# Altium schematic sheet top.SchDoc
size A
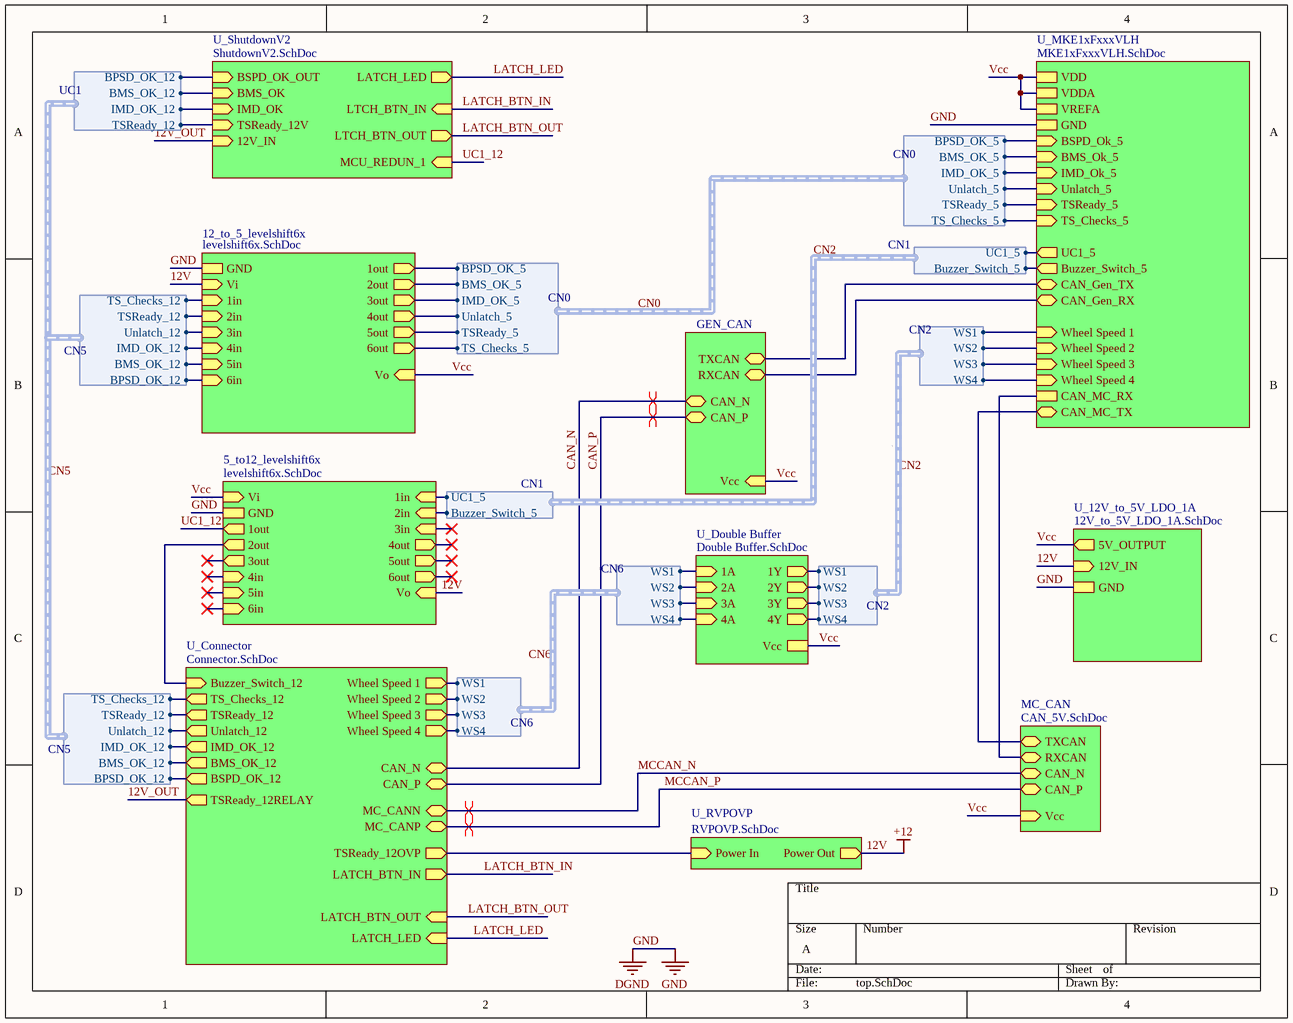
[diagram p0: top.SchDoc]

## Sub-sheets
5_to12_levelshift6x = levelshift6x.SchDoc: GND, Vi (in), 4in (in), 5in (in), 6in (in), 4out (out), 5out (out), 6out (out), Vo (in), 3out (out), 2out (out), 1out (out), 1in (in), 3in (in), 2in (in)
12_to_5_levelshift6x = levelshift6x.SchDoc: GND, Vi (in), Vo (in), 6in (in), 1out (out), 2out (out), 4in (in), 1in (in), 4out (out), 2in (in), 5in (in), 3out (out), 5out (out), 3in (in), 6out (out)
GEN_CAN = CAN_5V.SchDoc: TXCAN (bidir), RXCAN (bidir), CAN_N (bidir), CAN_P (bidir), Vcc (in)
MC_CAN = CAN_5V.SchDoc: TXCAN (bidir), RXCAN (bidir), CAN_N (bidir), CAN_P (bidir), Vcc (in)
U_12V_to_5V_LDO_1A = 12V_to_5V_LDO_1A.SchDoc: 12V_IN (in), 5V_OUTPUT (out), GND
U_Connector = Connector.SchDoc: BSPD_OK_12 (out), BMS_OK_12 (out), IMD_OK_12 (out), Unlatch_12 (out), TS_Checks_12 (out), TSReady_12 (out), Wheel Speed 1 (out), Wheel Speed 2 (out), Wheel Speed 3 (out), Wheel Speed 4 (out), MC_CANN (bidir), MC_CANP (bidir), CAN_N (bidir), CAN_P (bidir), TSReady_12OVP (out), LATCH_LED (in), LATCH_BTN_OUT (in), LATCH_BTN_IN (out), Buzzer_Switch_12 (in), TSReady_12RELAY (out)
U_Double Buffer = Double Buffer.SchDoc: 1A (in), 1Y (out), Vcc, 2A (in), 2Y (out), 4Y (out), 4A (in), 3Y (out), 3A (in)
U_MKE1xFxxxVLH = MKE1xFxxxVLH.SchDoc: VDD, VDDA, VREFA, GND, BSPD_Ok_5 (in), BMS_Ok_5 (in), IMD_Ok_5 (in), Unlatch_5 (in), TSReady_5 (in), TS_Checks_5 (in), UC1_5 (out), Buzzer_Switch_5 (out), CAN_Gen_TX (bidir), CAN_MC_RX, Wheel Speed 1 (in), Wheel Speed 2 (in), Wheel Speed 3 (in), Wheel Speed 4 (in), CAN_Gen_RX (bidir), CAN_MC_TX (bidir)
U_RVPOVP = RVPOVP.SchDoc: Power Out (out), Power In (in)
U_ShutdownV2 = ShutdownV2.SchDoc: BMS_OK (in), IMD_OK (in), MCU_REDUN_1 (in), LATCH_LED (out), TSReady_12V (in), LTCH_BTN_OUT (out), LTCH_BTN_IN (in), BSPD_OK_OUT (in), 12V_IN (in)

## Harnesses
CN0: BPSD_OK_5, BMS_OK_5, IMD_OK_5, Unlatch_5, TSReady_5, TS_Checks_5
CN1: UC1_5, Buzzer_Switch_5
CN2: WS1, WS2, WS3, WS4
CN6: WS4, WS3, WS2, WS1
CN0: TS_Checks_5, TSReady_5, Unlatch_5, IMD_OK_5, BMS_OK_5, BPSD_OK_5
UC1: BPSD_OK_12, BMS_OK_12, IMD_OK_12, TSReady_12
CN5: Unlatch_12, TSReady_12, TS_Checks_12, IMD_OK_12, BMS_OK_12, BPSD_OK_12
CN6: WS1, WS2, WS3, WS4

## Nets
12V: sheet 12_to_5_levelshift6x/Vi, sheet 5_to12_levelshift6x/Vo, sheet U_12V_to_5V_LDO_1A/12V_IN, sheet U_RVPOVP/Power Out  [also labelled +12]
GND: sheet 12_to_5_levelshift6x/GND, sheet 5_to12_levelshift6x/GND, sheet U_MKE1xFxxxVLH/GND, sheet U_12V_to_5V_LDO_1A/GND  [also labelled DGND]
12V_OUT: sheet U_Connector/TSReady_12RELAY, sheet U_ShutdownV2/12V_IN
CAN_N: sheet GEN_CAN/CAN_N, sheet U_Connector/CAN_N
CAN_P: sheet GEN_CAN/CAN_P, sheet U_Connector/CAN_P
CN0.BMS_OK_5: sheet 12_to_5_levelshift6x/2out, sheet U_MKE1xFxxxVLH/BMS_Ok_5, harness CN0.BMS_OK_5
CN0.BPSD_OK_5: sheet 12_to_5_levelshift6x/1out, sheet U_MKE1xFxxxVLH/BSPD_Ok_5, harness CN0.BPSD_OK_5
CN0.IMD_OK_5: sheet 12_to_5_levelshift6x/3out, sheet U_MKE1xFxxxVLH/IMD_Ok_5, harness CN0.IMD_OK_5
CN0.TS_Checks_5: sheet 12_to_5_levelshift6x/6out, sheet U_MKE1xFxxxVLH/TS_Checks_5, harness CN0.TS_Checks_5
CN0.TSReady_5: sheet 12_to_5_levelshift6x/5out, sheet U_MKE1xFxxxVLH/TSReady_5, harness CN0.TSReady_5
CN0.Unlatch_5: sheet 12_to_5_levelshift6x/4out, sheet U_MKE1xFxxxVLH/Unlatch_5, harness CN0.Unlatch_5
CN2.Buzzer_Switch_5: sheet 5_to12_levelshift6x/2in, sheet U_MKE1xFxxxVLH/Buzzer_Switch_5, harness CN1.Buzzer_Switch_5
CN2.UC1_5: sheet 5_to12_levelshift6x/1in, sheet U_MKE1xFxxxVLH/UC1_5, harness CN1.UC1_5
CN2.WS1: sheet U_MKE1xFxxxVLH/Wheel Speed 1, sheet U_Double Buffer/1Y, harness CN2.WS1
CN2.WS2: sheet U_MKE1xFxxxVLH/Wheel Speed 2, sheet U_Double Buffer/2Y, harness CN2.WS2
CN2.WS3: sheet U_MKE1xFxxxVLH/Wheel Speed 3, sheet U_Double Buffer/3Y, harness CN2.WS3
CN2.WS4: sheet U_MKE1xFxxxVLH/Wheel Speed 4, sheet U_Double Buffer/4Y, harness CN2.WS4
CN5.BMS_OK_12: sheet 12_to_5_levelshift6x/5in, sheet U_Connector/BMS_OK_12, sheet U_ShutdownV2/BMS_OK, harness UC1.BMS_OK_12, harness CN5.BMS_OK_12
CN5.BPSD_OK_12: sheet 12_to_5_levelshift6x/6in, sheet U_Connector/BSPD_OK_12, sheet U_ShutdownV2/BSPD_OK_OUT, harness UC1.BPSD_OK_12, harness CN5.BPSD_OK_12
CN5.IMD_OK_12: sheet 12_to_5_levelshift6x/4in, sheet U_Connector/IMD_OK_12, sheet U_ShutdownV2/IMD_OK, harness UC1.IMD_OK_12, harness CN5.IMD_OK_12
CN5.TS_Checks_12: sheet 12_to_5_levelshift6x/1in, sheet U_Connector/TS_Checks_12, harness CN5.TS_Checks_12
CN5.TSReady_12: sheet 12_to_5_levelshift6x/2in, sheet U_Connector/TSReady_12, sheet U_ShutdownV2/TSReady_12V, harness UC1.TSReady_12, harness CN5.TSReady_12
CN5.Unlatch_12: sheet 12_to_5_levelshift6x/3in, sheet U_Connector/Unlatch_12, harness CN5.Unlatch_12
CN6.WS1: sheet U_Connector/Wheel Speed 1, sheet U_Double Buffer/1A, harness CN6.WS1
CN6.WS2: sheet U_Connector/Wheel Speed 2, sheet U_Double Buffer/2A, harness CN6.WS2
CN6.WS3: sheet U_Connector/Wheel Speed 3, sheet U_Double Buffer/3A, harness CN6.WS3
CN6.WS4: sheet U_Connector/Wheel Speed 4, sheet U_Double Buffer/4A, harness CN6.WS4
LATCH_BTN_IN: sheet U_Connector/LATCH_BTN_IN, sheet U_ShutdownV2/LTCH_BTN_IN
LATCH_BTN_OUT: sheet U_Connector/LATCH_BTN_OUT, sheet U_ShutdownV2/LTCH_BTN_OUT
LATCH_LED: sheet U_Connector/LATCH_LED, sheet U_ShutdownV2/LATCH_LED
MCCAN_N: sheet MC_CAN/CAN_N, sheet U_Connector/MC_CANN
MCCAN_P: sheet MC_CAN/CAN_P, sheet U_Connector/MC_CANP
UC1_12: sheet 5_to12_levelshift6x/1out, sheet U_ShutdownV2/MCU_REDUN_1
Vcc: sheet GEN_CAN/Vcc, sheet 12_to_5_levelshift6x/Vo, sheet 5_to12_levelshift6x/Vi, sheet MC_CAN/Vcc, sheet U_MKE1xFxxxVLH/VDD, sheet U_MKE1xFxxxVLH/VDDA, sheet U_MKE1xFxxxVLH/VREFA, sheet U_12V_to_5V_LDO_1A/5V_OUTPUT, sheet U_Double Buffer/Vcc
(unnamed): sheet GEN_CAN/TXCAN, sheet U_MKE1xFxxxVLH/CAN_Gen_TX
(unnamed): sheet GEN_CAN/RXCAN, sheet U_MKE1xFxxxVLH/CAN_Gen_RX
(unnamed): sheet 5_to12_levelshift6x/2out, sheet U_Connector/Buzzer_Switch_12
(unnamed): sheet MC_CAN/TXCAN, sheet U_MKE1xFxxxVLH/CAN_MC_TX
(unnamed): sheet MC_CAN/RXCAN, sheet U_MKE1xFxxxVLH/CAN_MC_RX
(unnamed): sheet U_Connector/TSReady_12OVP, sheet U_RVPOVP/Power In

## Layout directives
differential pair: CAN_N, CAN_P, MCCAN_N, MCCAN_P